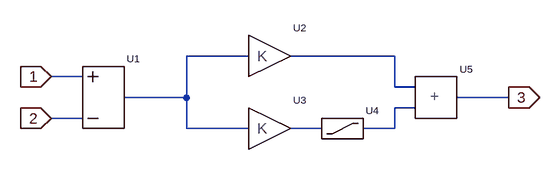
[diagram p0: schematic PI.asc]
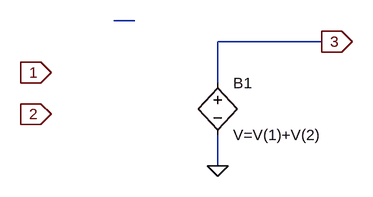
[diagram p1: sub-circuit adder.asc]
PI.asc, the LTspice schematic file:
Version 4
SHEET 1 880 680
WIRE 400 80 304 80
WIRE 624 80 464 80
WIRE 144 112 96 112
WIRE 624 128 624 80
WIRE 656 128 624 128
WIRE 304 144 304 80
WIRE 304 144 208 144
WIRE 800 144 720 144
WIRE 656 160 624 160
WIRE 144 176 96 176
WIRE 304 192 304 144
WIRE 400 192 304 192
WIRE 512 192 464 192
WIRE 624 192 624 160
WIRE 624 192 576 192
FLAG 96 112 1
IOPIN 96 112 In
FLAG 96 176 2
IOPIN 96 176 In
FLAG 800 144 3
IOPIN 800 144 Out
SYMBOL subtractor 160 112 R0
SYMATTR InstName U1
SYMBOL gain 416 80 R0
SYMATTR InstName U2
SYMATTR Value {Kp}
SYMBOL gain 416 192 R0
SYMATTR InstName U3
SYMATTR Value {Ki}
SYMBOL integral 544 192 R0
SYMATTR InstName U4
SYMBOL adder 688 144 R0
SYMATTR InstName U5

adder.asc, the sub-circuit schematic file:
Version 4
SHEET 1 880 680
WIRE 80 48 48 48
WIRE 368 80 208 80
WIRE 208 144 208 80
WIRE 208 272 208 224
FLAG -48 128 1
IOPIN -48 128 In
FLAG -48 192 2
IOPIN -48 192 In
FLAG 208 272 0
FLAG 368 80 3
IOPIN 368 80 Out
SYMBOL bv 208 128 R0
SYMATTR InstName B1
SYMATTR Value V=V(1)+V(2)

The netlist it stands for:
* PI.asc
XU1 1 2 N001 subtract  ; pins 1 2 3
XU2 N001 N002 gain {Kp}  ; pins 1 2
XU3 N001 N004 gain {Ki}  ; pins 1 2
XU4 N004 N003 integral  ; pins 1 2
XU5 N002 N003 3 adder

* block symbol definitions
.subckt adder 1 2 3
B1 3 0 V=V(1)+V(2)
.ends adder

.lib subtractor.lib
.lib gain.lib
.lib integral.lib
.lib adder.lib
.backanno
.end